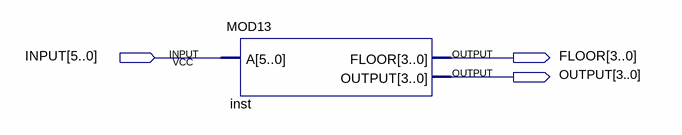
[diagram p0: schematic sheet]
// Quartus schematic test.bdf as structural Verilog: 1 symbols, 3 pins
module test (
  input  [5:0] INPUT,
  output [3:0] FLOOR,
  output [3:0] OUTPUT
);

  MOD13 inst (.A(INPUT), .FLOOR(FLOOR), .OUTPUT(OUTPUT));
endmodule
